# Altium schematic sheet Sense Amplifier.SchDoc
size A4; SheetNumber: 7; SheetTotal: 7
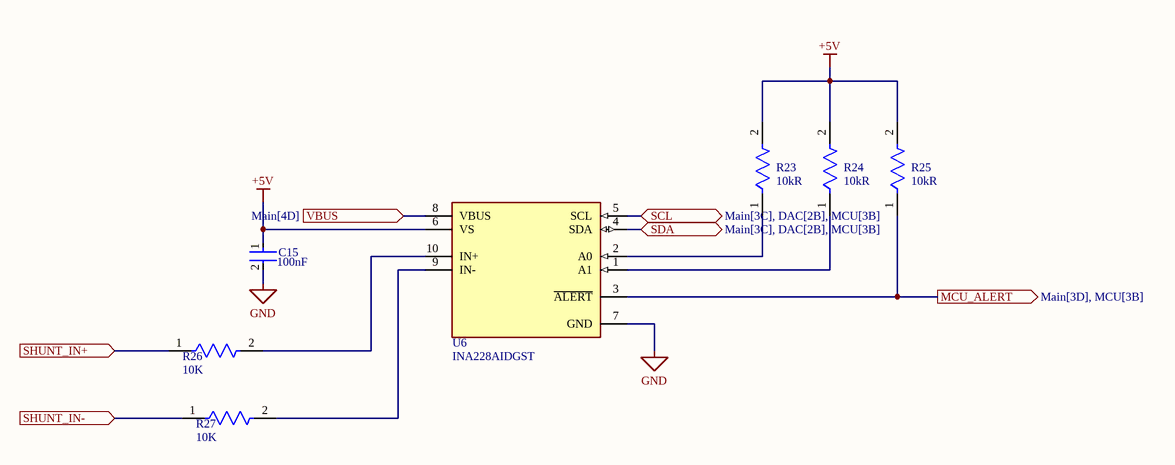
[diagram p0: Sense Amplifier.SchDoc]

## Parts
C15  Capacitance: 100nF  [FP-C2012-125-0_45-MFG]  (hidden comment: C2012X7T2E104K125AE)
R23  Resistance: 10kR  [FP-ERJP06-MFG]  (hidden comment: ERJ-P06F1002V)
R24  Resistance: 10kR  [FP-ERJP06-MFG]  (hidden comment: ERJ-P06F1002V)
R25  Resistance: 10kR  [FP-ERJP06-MFG]  (hidden comment: ERJ-P06F1002V)
R26  10K  [FP-ERJP06-MFG]
R27  10K  [FP-ERJP06-MFG]
U6  INA228AIDGST  [FP-DGS0010A-IPC_A]

## Ports
MCU_ALERT (out, see Main[3D], MCU[3B]), SCL (bidir, see Main[3C], DAC[2B], MCU[3B]), SDA (bidir, see Main[3C], DAC[2B], MCU[3B]), SHUNT_IN+ (in, see Main[4C], Analog[3C]), SHUNT_IN- (in, see Main[4C], Analog[3D]), VBUS (in, see Main[4D])

## Nets
+5V: C15.1 R23.2 R24.2 R25.2 U6.6(VS)
GND: C15.2 U6.7(GND)
MCU_ALERT: R25.1 U6.3(~{ALERT}) ; port MCU_ALERT
SCL: U6.5(SCL) ; port SCL
SDA: U6.4(SDA) ; port SDA
SHUNT_IN+: R26.1 ; port SHUNT_IN+
SHUNT_IN-: R27.1 ; port SHUNT_IN-
VBUS: U6.8(VBUS) ; port VBUS
NetR23_1: R23.1 U6.2(A0)
NetR24_1: R24.1 U6.1(A1)
NetR26_2: R26.2 U6.10(IN+)
NetR27_2: R27.2 U6.9(IN-)

## Library data of the parts
C15 = CMP-08246-004341-1: CAP CER 0.1UF 250V X7T 0805; Tolerance: 10%; Case Code (Metric): 2012; Package Quantity: 1; Max Operating Temperature: 125°C; Thickness: 0.049inch; Case Code (Imperial): 0805; Features: Soft Termination; Length: 2mm; Weight: 0.000194oz; Min Operating Temperature: -55°C; Case/Package: 0805; Mount: Surface Mount; REACH SVHC: No SVHC; Dielectric: X7T; Voltage Rating: 250V; Width: 0.05inch; Series: C; Packaging: Tape and Reel; Depth: 1.25mm; Resistor Type: Ceramic; Voltage Rating (DC): 250V; Height: 1.25mm; Termination: SMD/SMT; RoHS Compliant: Yes
R23-R25 = CMP-05422-000126-1: RES SMD 10K OHM 1% 1/2W 0805; Temperature Coefficient: 100ppm/°C; Voltage Rating (DC): 150V; Max Power Dissipation: 500mW; Termination: SMD/SMT; Tolerance: 1%; Width: 1.2mm; Case/Package: 0805; Number of Terminations: 2; Resistor Type: Thick Film; Radiation Hardening: No; Resistance Tolerance: 1%; Package Quantity: 5000; Max Operating Temperature: 155°C; RoHS Compliant: Yes; Mount: Surface Mount; Case Code (Imperial): 0805; Construction: Rectangular; Height: 0.6mm; Lead Free: Lead Free; Depth: 1.25mm; Packaging: Tape and Reel; REACH SVHC: No SVHC; Technology: THICK FILM; Features: Automotive AEC-Q200; Contact Plating: Tin; Voltage Rating: 150V; Military Standard: Not; Power Rating: 500mW; Case Code (Metric): 2012; Length: 2mm; Min Operating Temperature: -55°C; Series: ERJ
R26 R27 = CMP-05422-000126-1: RES SMD 10K OHM 1% 1/2W 0805; Temperature Coefficient: 100ppm/°C; Resistance: 10kR; Voltage Rating (DC): 150V; Max Power Dissipation: 500mW; Termination: SMD/SMT; Tolerance: 1%; Width: 1.2mm; Case/Package: 0805; Number of Terminations: 2; Resistor Type: Thick Film; Radiation Hardening: No; Resistance Tolerance: 1%; Package Quantity: 5000; Max Operating Temperature: 155°C; RoHS Compliant: Yes; Mount: Surface Mount; Case Code (Imperial): 0805; Construction: Rectangular; Height: 0.6mm; Lead Free: Lead Free; Depth: 1.25mm; Packaging: Tape and Reel; REACH SVHC: No SVHC; Technology: THICK FILM; Features: Automotive AEC-Q200; Contact Plating: Tin; Voltage Rating: 150V; Military Standard: Not; Power Rating: 500mW; Case Code (Metric): 2012; Length: 2mm; Min Operating Temperature: -55°C; Series: ERJ
U6 = CMP-04895-000416-1: 85-V, 20-BIT, ULTRA-PRECISE, I2C